# Altium schematic sheet main_scheme.SchDoc
size A2; DocumentNumber: 1; SheetNumber: 1; SheetTotal: 5
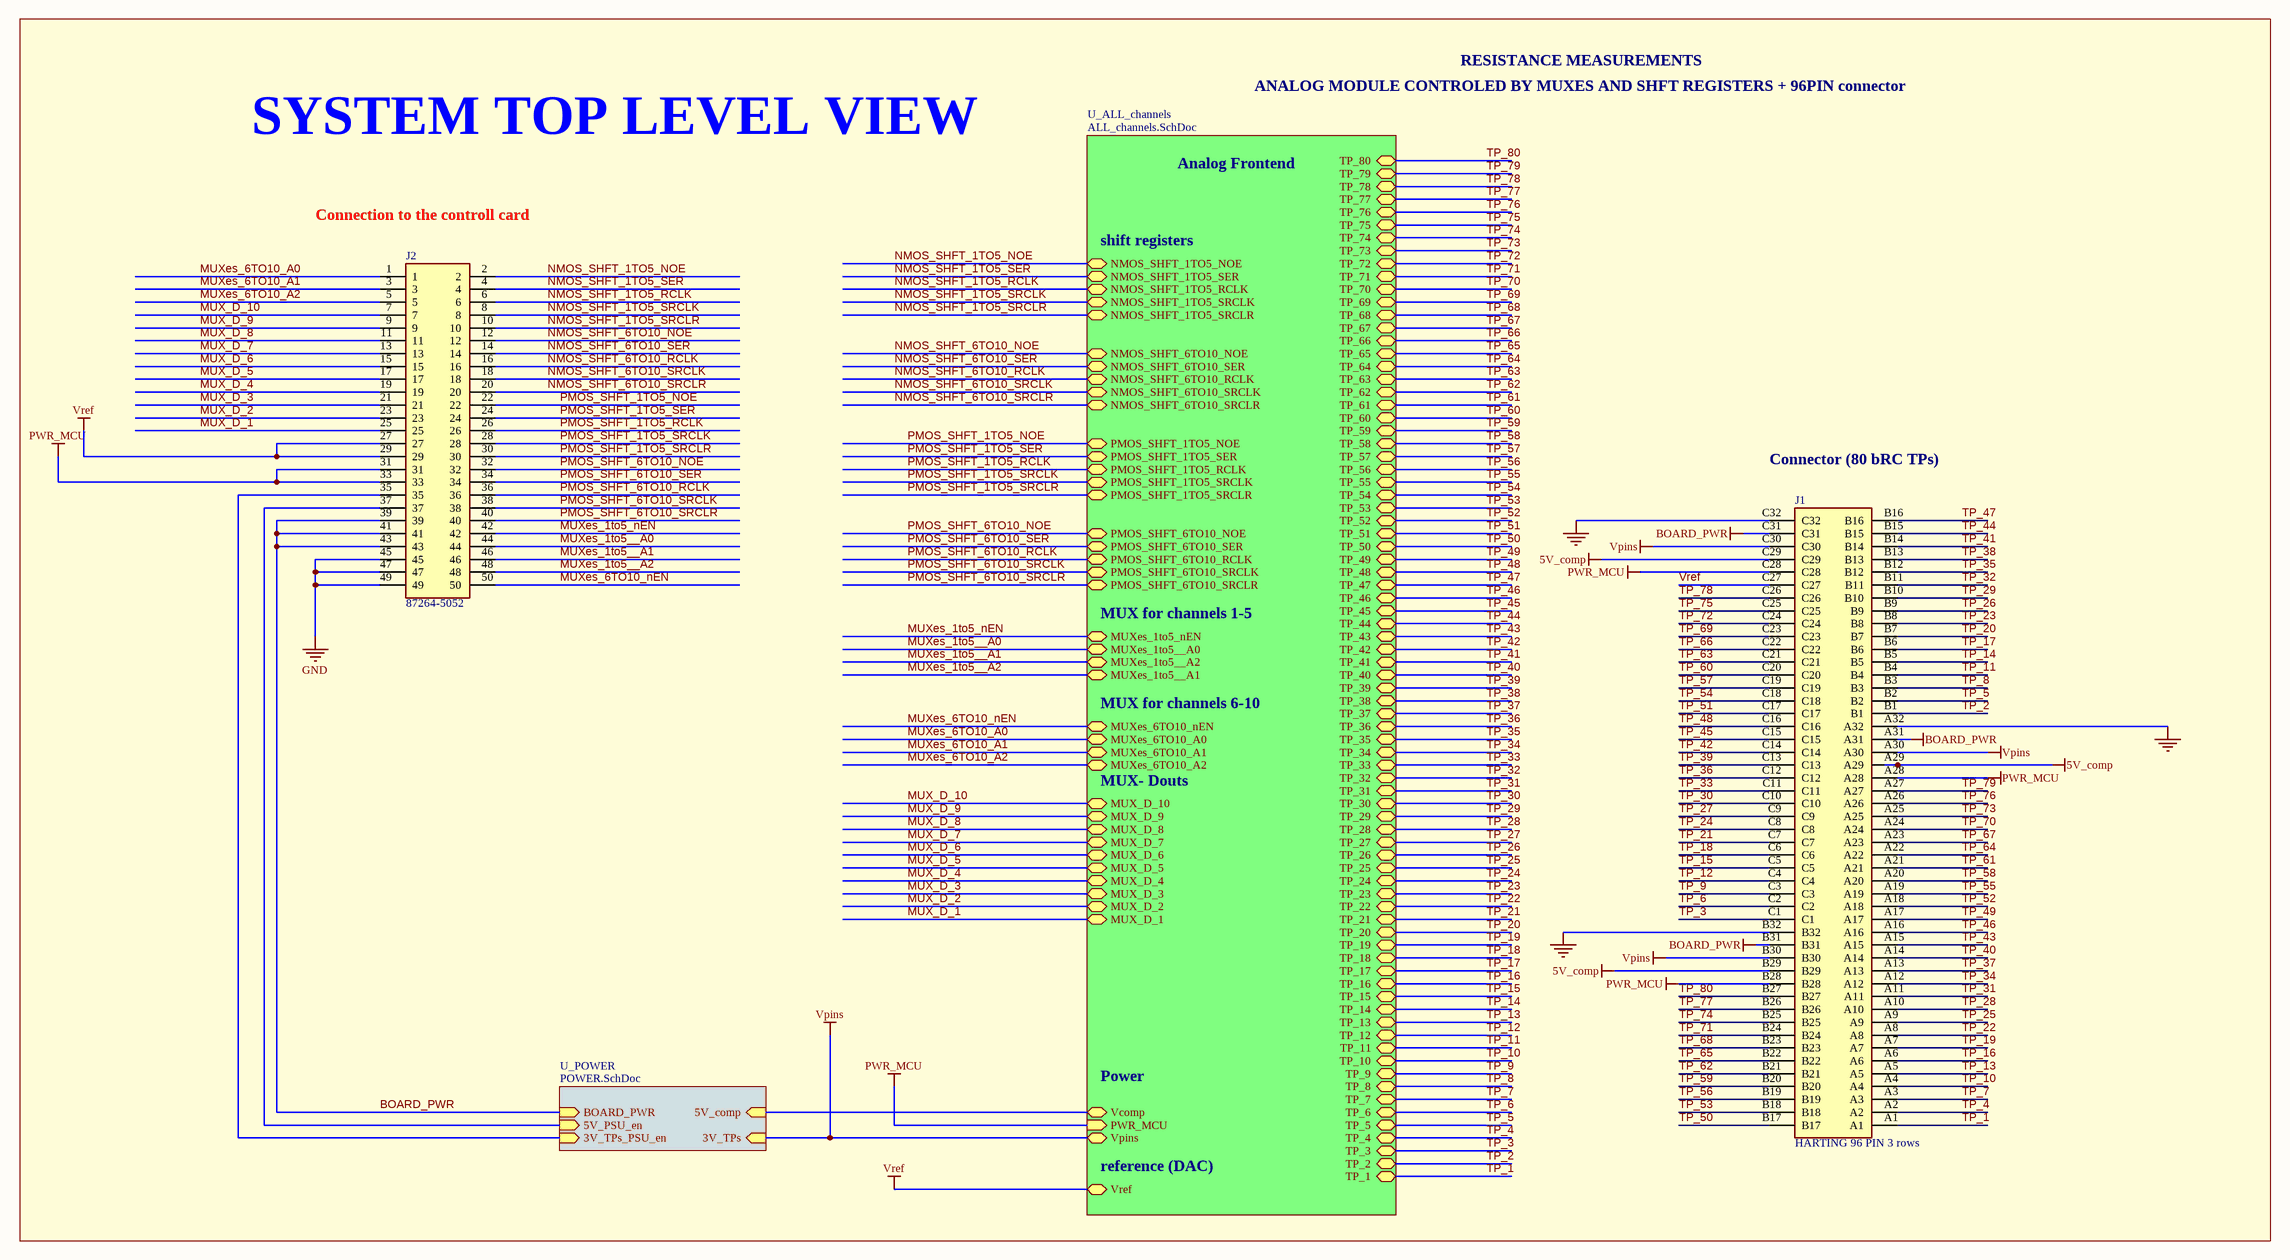
[diagram p0: main_scheme.SchDoc]

## Parts
J1  HARTING 96 PIN 3 rows  [09033966921 - NO_3D]
J2  87264-5052  [872645052]

## Blocks framed on the sheet
SYSTEM TOP LEVEL VIEW: J1 J2

## Sub-sheets
U_ALL_channels = ALL_channels.SchDoc: NMOS_SHFT_1TO5_SER (bidir), NMOS_SHFT_1TO5_NOE (bidir), NMOS_SHFT_1TO5_SRCLR (bidir), NMOS_SHFT_1TO5_SRCLK (bidir), NMOS_SHFT_1TO5_RCLK (bidir), PMOS_SHFT_1TO5_SER (bidir), PMOS_SHFT_1TO5_NOE (bidir), PMOS_SHFT_1TO5_SRCLR (bidir), PMOS_SHFT_1TO5_SRCLK (bidir), PMOS_SHFT_1TO5_RCLK (bidir), TP_1 (bidir), TP_2 (bidir), TP_3 (bidir), TP_4 (bidir), TP_5 (bidir), TP_6 (bidir), TP_7 (bidir), TP_8 (bidir), TP_9 (bidir), TP_10 (bidir), TP_11 (bidir), TP_12 (bidir), TP_13 (bidir), TP_14 (bidir), TP_15 (bidir), TP_16 (bidir), TP_17 (bidir), TP_18 (bidir), TP_19 (bidir), TP_20 (bidir), TP_21 (bidir), TP_22 (bidir), TP_23 (bidir), TP_24 (bidir), TP_25 (bidir), TP_26 (bidir), TP_27 (bidir), TP_28 (bidir), TP_29 (bidir), TP_30 (bidir), TP_31 (bidir), TP_32 (bidir), TP_33 (bidir), TP_34 (bidir), TP_35 (bidir), TP_36 (bidir), TP_37 (bidir), TP_38 (bidir), TP_39 (bidir), TP_40 (bidir), MUX_D_1 (bidir), NMOS_SHFT_6TO10_SER (bidir), NMOS_SHFT_6TO10_NOE (bidir), NMOS_SHFT_6TO10_SRCLR (bidir), NMOS_SHFT_6TO10_SRCLK (bidir), NMOS_SHFT_6TO10_RCLK (bidir), PMOS_SHFT_6TO10_SER (bidir), PMOS_SHFT_6TO10_NOE (bidir), PMOS_SHFT_6TO10_SRCLR (bidir), PMOS_SHFT_6TO10_SRCLK (bidir), PMOS_SHFT_6TO10_RCLK (bidir), MUX_D_2 (bidir), MUX_D_3 (bidir), MUX_D_4 (bidir), MUX_D_5 (bidir), MUX_D_6 (bidir), MUX_D_7 (bidir), MUX_D_8 (bidir), MUX_D_9 (bidir), MUX_D_10 (bidir), MUXes_1to5_nEN (bidir), MUXes_1to5__A0 (bidir), MUXes_1to5__A1 (bidir), MUXes_1to5__A2 (bidir), MUXes_6TO10_nEN (bidir), MUXes_6TO10_A0 (bidir), MUXes_6TO10_A1 (bidir), MUXes_6TO10_A2 (bidir), TP_41 (bidir), TP_42 (bidir), TP_43 (bidir), TP_44 (bidir), TP_45 (bidir), TP_46 (bidir), TP_47 (bidir), TP_48 (bidir), TP_49 (bidir), TP_50 (bidir), TP_51 (bidir), TP_52 (bidir), TP_53 (bidir), TP_54 (bidir), TP_55 (bidir), TP_56 (bidir), TP_57 (bidir), TP_58 (bidir), TP_59 (bidir), TP_60 (bidir), TP_61 (bidir), TP_62 (bidir), TP_63 (bidir), TP_64 (bidir), TP_65 (bidir), TP_66 (bidir), TP_67 (bidir), TP_68 (bidir), TP_69 (bidir), TP_70 (bidir), TP_71 (bidir), TP_72 (bidir), TP_73 (bidir), TP_74 (bidir), TP_75 (bidir), TP_76 (bidir), TP_77 (bidir), TP_78 (bidir), TP_79 (bidir), TP_80 (bidir), Vcomp (bidir), Vref (bidir), PWR_MCU (in), Vpins (bidir)
U_POWER = POWER.SchDoc: 3V_TPs (in), 3V_TPs_PSU_en (in), 5V_PSU_en (in), BOARD_PWR (in), 5V_comp (in)

## Nets
5V_comp: J1.A29 J1.B29 J1.C29
BOARD_PWR: J1.A31 J1.B31 J1.C31 J2.39 J2.41 J2.43 ; sheet U_POWER/BOARD_PWR
GND: J1.A32 J1.B32 J1.C32 J2.45 J2.47 J2.49
PWR_MCU: J1.A28 J1.B28 J1.C28 J2.31 J2.33 ; sheet U_ALL_channels/PWR_MCU
Vpins: J1.A30 J1.B30 J1.C30 ; sheet U_ALL_channels/Vpins, sheet U_POWER/3V_TPs
Vref: J1.C27 J2.27 J2.29 ; sheet U_ALL_channels/Vref
MUX_D_1: J2.25 ; sheet U_ALL_channels/MUX_D_1
MUX_D_2: J2.23 ; sheet U_ALL_channels/MUX_D_2
MUX_D_3: J2.21 ; sheet U_ALL_channels/MUX_D_3
MUX_D_4: J2.19 ; sheet U_ALL_channels/MUX_D_4
MUX_D_5: J2.17 ; sheet U_ALL_channels/MUX_D_5
MUX_D_6: J2.15 ; sheet U_ALL_channels/MUX_D_6
MUX_D_7: J2.13 ; sheet U_ALL_channels/MUX_D_7
MUX_D_8: J2.11 ; sheet U_ALL_channels/MUX_D_8
MUX_D_9: J2.9 ; sheet U_ALL_channels/MUX_D_9
MUX_D_10: J2.7 ; sheet U_ALL_channels/MUX_D_10
MUXes_1to5__A0: J2.44 ; sheet U_ALL_channels/MUXes_1to5__A0
MUXes_1to5__A1: J2.46 ; sheet U_ALL_channels/MUXes_1to5__A2
MUXes_1to5__A2: J2.48 ; sheet U_ALL_channels/MUXes_1to5__A1
MUXes_1to5_nEN: J2.42 ; sheet U_ALL_channels/MUXes_1to5_nEN
MUXes_6TO10_A0: J2.1 ; sheet U_ALL_channels/MUXes_6TO10_A0
MUXes_6TO10_A1: J2.3 ; sheet U_ALL_channels/MUXes_6TO10_A1
MUXes_6TO10_A2: J2.5 ; sheet U_ALL_channels/MUXes_6TO10_A2
MUXes_6TO10_nEN: J2.50 ; sheet U_ALL_channels/MUXes_6TO10_nEN
NMOS_SHFT_1TO5_NOE: J2.2 ; sheet U_ALL_channels/NMOS_SHFT_1TO5_NOE
NMOS_SHFT_1TO5_RCLK: J2.6 ; sheet U_ALL_channels/NMOS_SHFT_1TO5_RCLK
NMOS_SHFT_1TO5_SER: J2.4 ; sheet U_ALL_channels/NMOS_SHFT_1TO5_SER
NMOS_SHFT_1TO5_SRCLK: J2.8 ; sheet U_ALL_channels/NMOS_SHFT_1TO5_SRCLK
NMOS_SHFT_1TO5_SRCLR: J2.10 ; sheet U_ALL_channels/NMOS_SHFT_1TO5_SRCLR
NMOS_SHFT_6TO10_NOE: J2.12 ; sheet U_ALL_channels/NMOS_SHFT_6TO10_NOE
NMOS_SHFT_6TO10_RCLK: J2.16 ; sheet U_ALL_channels/NMOS_SHFT_6TO10_RCLK
NMOS_SHFT_6TO10_SER: J2.14 ; sheet U_ALL_channels/NMOS_SHFT_6TO10_SER
NMOS_SHFT_6TO10_SRCLK: J2.18 ; sheet U_ALL_channels/NMOS_SHFT_6TO10_SRCLK
NMOS_SHFT_6TO10_SRCLR: J2.20 ; sheet U_ALL_channels/NMOS_SHFT_6TO10_SRCLR
PMOS_SHFT_1TO5_NOE: J2.22 ; sheet U_ALL_channels/PMOS_SHFT_1TO5_NOE
PMOS_SHFT_1TO5_RCLK: J2.26 ; sheet U_ALL_channels/PMOS_SHFT_1TO5_RCLK
PMOS_SHFT_1TO5_SER: J2.24 ; sheet U_ALL_channels/PMOS_SHFT_1TO5_SER
PMOS_SHFT_1TO5_SRCLK: J2.28 ; sheet U_ALL_channels/PMOS_SHFT_1TO5_SRCLK
PMOS_SHFT_1TO5_SRCLR: J2.30 ; sheet U_ALL_channels/PMOS_SHFT_1TO5_SRCLR
PMOS_SHFT_6TO10_NOE: J2.32 ; sheet U_ALL_channels/PMOS_SHFT_6TO10_NOE
PMOS_SHFT_6TO10_RCLK: J2.36 ; sheet U_ALL_channels/PMOS_SHFT_6TO10_RCLK
PMOS_SHFT_6TO10_SER: J2.34 ; sheet U_ALL_channels/PMOS_SHFT_6TO10_SER
PMOS_SHFT_6TO10_SRCLK: J2.38 ; sheet U_ALL_channels/PMOS_SHFT_6TO10_SRCLK
PMOS_SHFT_6TO10_SRCLR: J2.40 ; sheet U_ALL_channels/PMOS_SHFT_6TO10_SRCLR
TP_1: J1.A1 ; sheet U_ALL_channels/TP_1
TP_2: J1.B1 ; sheet U_ALL_channels/TP_2
TP_3: J1.C1 ; sheet U_ALL_channels/TP_3
TP_4: J1.A2 ; sheet U_ALL_channels/TP_4
TP_5: J1.B2 ; sheet U_ALL_channels/TP_5
TP_6: J1.C2 ; sheet U_ALL_channels/TP_6
TP_7: J1.A3 ; sheet U_ALL_channels/TP_7
TP_8: J1.B3 ; sheet U_ALL_channels/TP_8
TP_9: J1.C3 ; sheet U_ALL_channels/TP_9
TP_10: J1.A4 ; sheet U_ALL_channels/TP_10
TP_11: J1.B4 ; sheet U_ALL_channels/TP_11
TP_12: J1.C4 ; sheet U_ALL_channels/TP_12
TP_13: J1.A5 ; sheet U_ALL_channels/TP_13
TP_14: J1.B5 ; sheet U_ALL_channels/TP_14
TP_15: J1.C5 ; sheet U_ALL_channels/TP_15
TP_16: J1.A6 ; sheet U_ALL_channels/TP_16
TP_17: J1.B6 ; sheet U_ALL_channels/TP_17
TP_18: J1.C6 ; sheet U_ALL_channels/TP_18
TP_19: J1.A7 ; sheet U_ALL_channels/TP_19
TP_20: J1.B7 ; sheet U_ALL_channels/TP_20
TP_21: J1.C7 ; sheet U_ALL_channels/TP_21
TP_22: J1.A8 ; sheet U_ALL_channels/TP_22
TP_23: J1.B8 ; sheet U_ALL_channels/TP_23
TP_24: J1.C8 ; sheet U_ALL_channels/TP_24
TP_25: J1.A9 ; sheet U_ALL_channels/TP_25
TP_26: J1.B9 ; sheet U_ALL_channels/TP_26
TP_27: J1.C9 ; sheet U_ALL_channels/TP_27
TP_28: J1.A10 ; sheet U_ALL_channels/TP_28
TP_29: J1.B10 ; sheet U_ALL_channels/TP_29
TP_30: J1.C10 ; sheet U_ALL_channels/TP_30
TP_31: J1.A11 ; sheet U_ALL_channels/TP_31
TP_32: J1.B11 ; sheet U_ALL_channels/TP_32
TP_33: J1.C11 ; sheet U_ALL_channels/TP_33
TP_34: J1.A12 ; sheet U_ALL_channels/TP_34
TP_35: J1.B12 ; sheet U_ALL_channels/TP_35
TP_36: J1.C12 ; sheet U_ALL_channels/TP_36
TP_37: J1.A13 ; sheet U_ALL_channels/TP_37
TP_38: J1.B13 ; sheet U_ALL_channels/TP_38
TP_39: J1.C13 ; sheet U_ALL_channels/TP_39
TP_40: J1.A14 ; sheet U_ALL_channels/TP_40
TP_41: J1.B14 ; sheet U_ALL_channels/TP_41
TP_42: J1.C14 ; sheet U_ALL_channels/TP_42
TP_43: J1.A15 ; sheet U_ALL_channels/TP_43
TP_44: J1.B15 ; sheet U_ALL_channels/TP_44
TP_45: J1.C15 ; sheet U_ALL_channels/TP_45
TP_46: J1.A16 ; sheet U_ALL_channels/TP_46
TP_47: J1.B16 ; sheet U_ALL_channels/TP_47
TP_48: J1.C16 ; sheet U_ALL_channels/TP_48
TP_49: J1.A17 ; sheet U_ALL_channels/TP_49
TP_50: J1.B17 ; sheet U_ALL_channels/TP_50
TP_51: J1.C17 ; sheet U_ALL_channels/TP_51
TP_52: J1.A18 ; sheet U_ALL_channels/TP_52
TP_53: J1.B18 ; sheet U_ALL_channels/TP_53
TP_54: J1.C18 ; sheet U_ALL_channels/TP_54
TP_55: J1.A19 ; sheet U_ALL_channels/TP_55
TP_56: J1.B19 ; sheet U_ALL_channels/TP_56
TP_57: J1.C19 ; sheet U_ALL_channels/TP_57
TP_58: J1.A20 ; sheet U_ALL_channels/TP_58
TP_59: J1.B20 ; sheet U_ALL_channels/TP_59
TP_60: J1.C20 ; sheet U_ALL_channels/TP_60
TP_61: J1.A21 ; sheet U_ALL_channels/TP_61
TP_62: J1.B21 ; sheet U_ALL_channels/TP_62
TP_63: J1.C21 ; sheet U_ALL_channels/TP_63
TP_64: J1.A22 ; sheet U_ALL_channels/TP_64
TP_65: J1.B22 ; sheet U_ALL_channels/TP_65
TP_66: J1.C22 ; sheet U_ALL_channels/TP_66
TP_67: J1.A23 ; sheet U_ALL_channels/TP_67
TP_68: J1.B23 ; sheet U_ALL_channels/TP_68
TP_69: J1.C23 ; sheet U_ALL_channels/TP_69
TP_70: J1.A24 ; sheet U_ALL_channels/TP_70
TP_71: J1.B24 ; sheet U_ALL_channels/TP_71
TP_72: J1.C24 ; sheet U_ALL_channels/TP_72
TP_73: J1.A25 ; sheet U_ALL_channels/TP_73
TP_74: J1.B25 ; sheet U_ALL_channels/TP_74
TP_75: J1.C25 ; sheet U_ALL_channels/TP_75
TP_76: J1.A26 ; sheet U_ALL_channels/TP_76
TP_77: J1.B26 ; sheet U_ALL_channels/TP_77
TP_78: J1.C26 ; sheet U_ALL_channels/TP_78
TP_79: J1.A27 ; sheet U_ALL_channels/TP_79
TP_80: J1.B27 ; sheet U_ALL_channels/TP_80
NetJ2_35: J2.35 ; sheet U_POWER/3V_TPs_PSU_en
NetJ2_37: J2.37 ; sheet U_POWER/5V_PSU_en
(unnamed): sheet U_ALL_channels/Vcomp, sheet U_POWER/5V_comp

## Notes on the sheet
- RESISTANCE MEASUREMENTS
- ANALOG MODULE CONTROLED BY MUXES AND SHFT REGISTERS + 96PIN connector
- Analog Frontend
- Connection to the controll card
- shift registers
- Connector (80 bRC TPs)
- MUX for channels 1-5
- MUX for channels 6-10
- MUX- Douts
- Power
- reference (DAC)

## Library data of the parts
J1 = HARTING 96 PIN 3 rows: Connector; Manufacturer_Part_Number: 09033966921; Datasheet Link: https://b2b.harting.com/files/download/PRD/PDF_TS/0903396X921_100072506DRW414C.pdf?showPrivacyEmailAgreement=false&contextURL=https%3A%2F%2Fb2b.harting.com%2Febusiness%2Fen_us&siteName=Ebusiness+Site&autoLogoutEnabled=true&autoLogoutTime=1800; Height: 11.6mm; Manufacturer_Name: HARTING; Mouser Part Number: 617-09-03-396-6921; Mouser Price/Stock: https://www.mouser.co.uk/ProductDetail/HARTING/09033966921?qs=gIpPgrDBK%2FiSDuMebe5eaQ%3D%3D; Arrow Part Number: 09033966921; Arrow Price/Stock: https://www.arrow.com/en/products/09033966921/harting?region=europe
J2 = 87264-5052: Connector; Manufacturer_Name: Molex; Datasheet Link: https://datasheet.datasheetarchive.com/originals/dk/DKDS-17/324387.pdf; Height: 4mm; Manufacturer_Part_Number: 87264-5052; Mouser Part Number: 538-87264-5052; Mouser Price/Stock: https://www.mouser.co.uk/ProductDetail/Molex/87264-5052?qs=9Wl4wMk6Njq4xjq5OEy3Bw%3D%3D